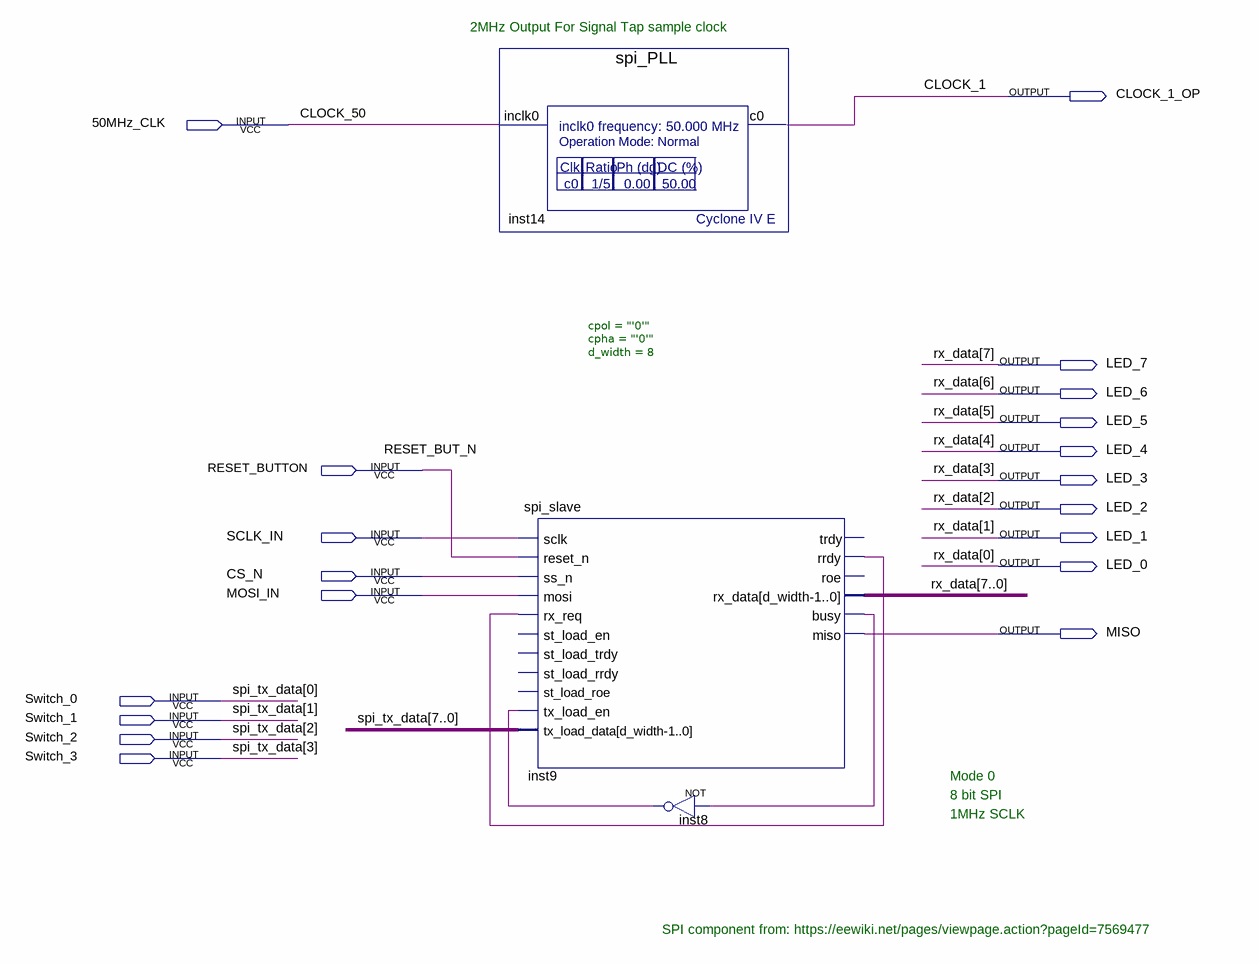
[diagram p0: schematic sheet]
// Quartus schematic spi_test.bdf as structural Verilog: 3 symbols, 19 pins
module spi_test (
  input  \50MHz_CLK ,
  input  RESET_BUTTON,
  input  SCLK_IN,
  input  CS_N,
  input  MOSI_IN,
  input  Switch_0,
  input  Switch_1,
  input  Switch_2,
  input  Switch_3,
  output CLOCK_1_OP,
  output LED_7,
  output LED_6,
  output LED_5,
  output LED_4,
  output LED_3,
  output LED_2,
  output LED_1,
  output LED_0,
  output MISO
);

  wire inst8_out, inst9_busy, inst9_rrdy;
  wire [7:4] spi_tx_data;

  spi_PLL inst14 (.inclk0(\50MHz_CLK ), .c0(CLOCK_1_OP));
  spi_slave #(.cpol("'0'"), .cpha("'0'"), .d_width(8)) inst9 (
    .sclk(SCLK_IN), .reset_n(RESET_BUTTON), .ss_n(CS_N), .mosi(MOSI_IN), .rx_req(inst9_rrdy),
    .tx_load_en(inst8_out), .tx_load_data({spi_tx_data, Switch_3, Switch_2, Switch_1, Switch_0}),
    .rrdy(inst9_rrdy), .rx_data({LED_7, LED_6, LED_5, LED_4, LED_3, LED_2, LED_1, LED_0}), .busy(inst9_busy),
    .miso(MISO));  // open: st_load_en, st_load_trdy, st_load_rrdy, st_load_roe, trdy, roe
  not inst8 (inst8_out, inst9_busy);

  // Other names for the same wires on the sheet: CLOCK_1 = CLOCK_1_OP; CLOCK_50 = \50MHz_CLK ;
  //   RESET_BUT_N = RESET_BUTTON; rx_data[7:0] = {LED_7, LED_6, LED_5, LED_4, LED_3, LED_2, LED_1, LED_0};
  //   spi_tx_data[3:0] = {Switch_3, Switch_2, Switch_1, Switch_0}

  // Notes on the sheet:
  //   2MHz Output For Signal Tap sample clock
  //   Mode 0
  //   8 bit SPI
  //   1MHz SCLK
  //   SPI component from: https://eewiki.net/pages/viewpage.action?pageId=7569477
endmodule
